# Altium schematic sheet power&interface.SchDoc
size A4
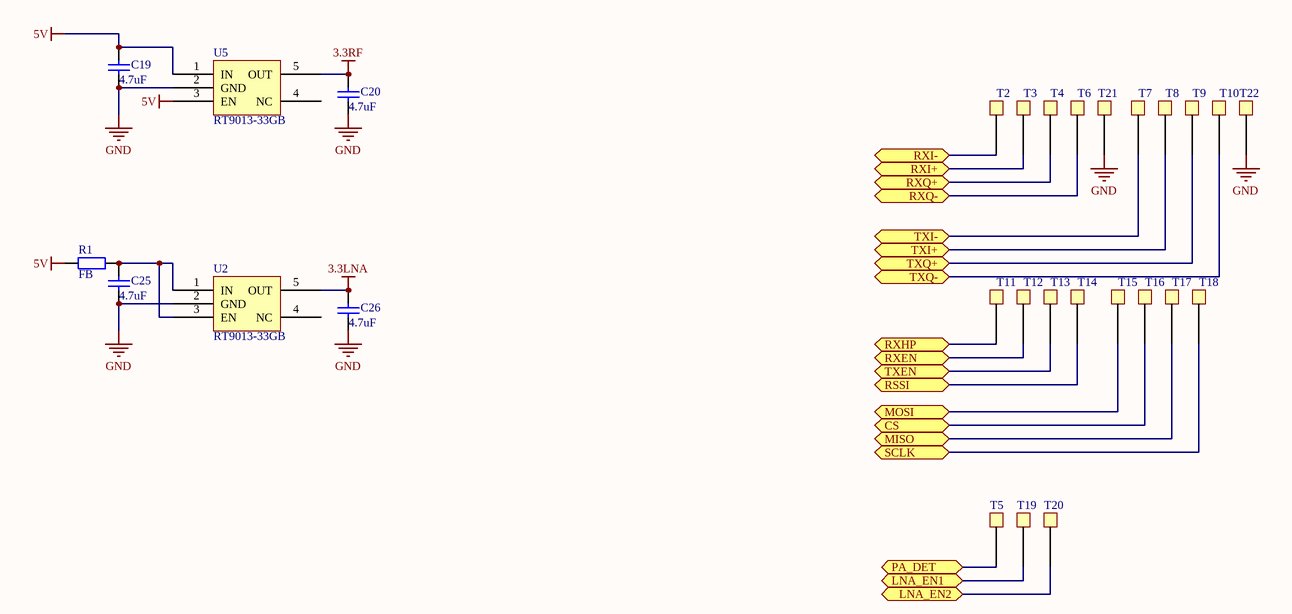
[diagram p0: power&interface.SchDoc]

## Parts
C19  4.7uF  [0603]
C20  4.7uF  [0603]
C25  4.7uF  [0603]
C26  4.7uF  [0603]
R1  FB  [0402]
T2  RXI-  [TestPad - 1mm]  (value not drawn)
T3  RXI-  [TestPad - 1mm]  (value not drawn)
T4  RXI-  [TestPad - 1mm]  (value not drawn)
T5  DET  [TestPad - 1mm]  (value not drawn)
T6  RXI-  [TestPad - 1mm]  (value not drawn)
T7  RXI-  [TestPad - 1mm]  (value not drawn)
T8  RXI-  [TestPad - 1mm]  (value not drawn)
T9  RXI-  [TestPad - 1mm]  (value not drawn)
T10  RXI-  [TestPad - 1mm]  (value not drawn)
T11  HP  [TestPad - 1mm]  (value not drawn)
T12  RX  [TestPad - 1mm]  (value not drawn)
T13  TX  [TestPad - 1mm]  (value not drawn)
T14  RSSI  [TestPad - 1mm]  (value not drawn)
T15  I  [TestPad - 1mm]  (value not drawn)
T16  CS  [TestPad - 1mm]  (value not drawn)
T17  O  [TestPad - 1mm]  (value not drawn)
T18  C  [TestPad - 1mm]  (value not drawn)
T19  L1  [TestPad - 1mm]  (value not drawn)
T20  L2  [TestPad - 1mm]  (value not drawn)
T21  VDET  [TestPad - 1mm]  (value not drawn)
T22  VDET  [TestPad - 1mm]  (value not drawn)
U2  RT9013-33GB  [SOT23-5]
U5  RT9013-33GB  [SOT23-5]

## Ports
CS, LNA_EN1, LNA_EN2, MISO, MOSI, PA_DET, RSSI, RXEN, RXHP, RXI+, RXI-, RXQ+, RXQ-, SCLK, TXEN, TXI+, TXI-, TXQ+, TXQ-

## Nets
3.3LNA: C26.2 U2.5(OUT)
3.3RF: C20.2 U5.5(OUT)
5V: C19.2 R1.2 U5.1(IN) U5.3(EN)
GND: C19.1 C20.1 C25.1 C26.1 T21.1 T22.1 U2.2(GND) U5.2(GND)
CS: T16.1 ; port CS
LNA_EN1: T19.1 ; port LNA_EN1
LNA_EN2: T20.1 ; port LNA_EN2
MISO: T17.1 ; port MISO
MOSI: T15.1 ; port MOSI
PA_DET: T5.1 ; port PA_DET
RSSI: T14.1 ; port RSSI
RXEN: T12.1 ; port RXEN
RXHP: T11.1 ; port RXHP
RXI+: T3.1 ; port RXI+
RXI-: T2.1 ; port RXI-
RXQ+: T4.1 ; port RXQ+
RXQ-: T6.1 ; port RXQ-
SCLK: T18.1 ; port SCLK
TXEN: T13.1 ; port TXEN
TXI+: T8.1 ; port TXI+
TXI-: T7.1 ; port TXI-
TXQ+: T9.1 ; port TXQ+
TXQ-: T10.1 ; port TXQ-
NetC25_2: C25.2 R1.1 U2.1(IN) U2.3(EN)

Not connected (* = marked no-connect by the designer): U2 4(NC); U5 4(NC)

## Library data of the parts
C19 C20 C25 C26 = Cap: Capacitor; Published: 8-Jun-2000; LatestRevisionDate: 17-Jul-2002; LatestRevisionNote: Re-released for DXP Platform.; PackageReference: RAD-0.3; Publisher: Altium Limited; PackageDescription: Radial Cap, Thru-Hole; 2 Leads; 0.3 in Pin Spacing
R1 = Res2: Resistor; Published: 8-Jun-2000; LatestRevisionDate: 17-Jul-2002; LatestRevisionNote: Re-released for DXP Platform.; PackageReference: AXIAL-0.4; Publisher: Altium Limited; PackageDescription: Axial Device, Thru-Hole; 2 Leads; 0.4 in Pin Spacing
T2-T22 = TestPad
U2 U5 = LP5907